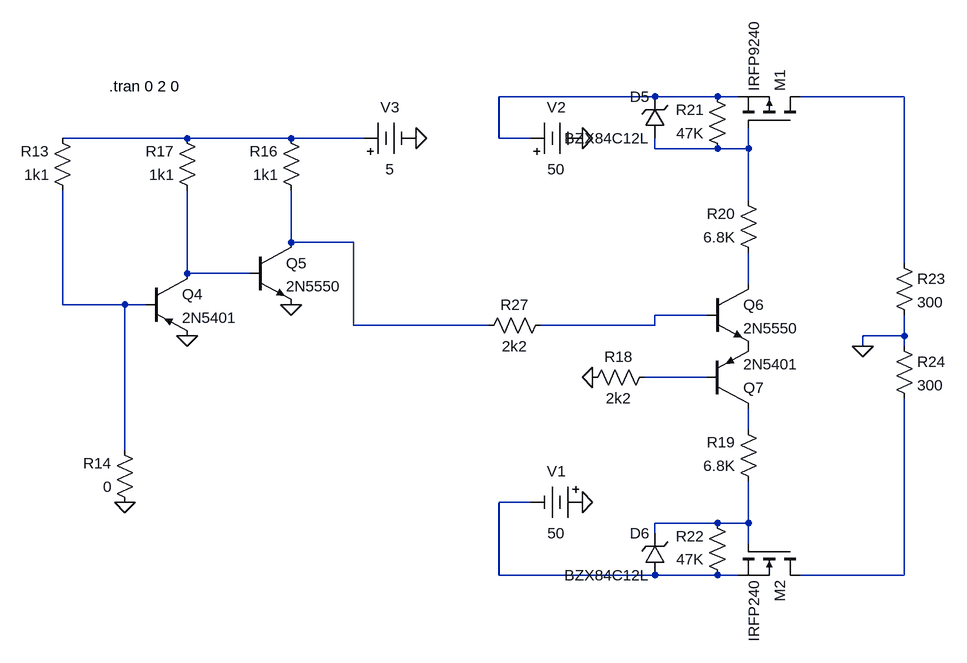
[diagram p0: schematic spkprot1.asc]
spkprot1.asc, the LTspice schematic file:
Version 4
SHEET 1 2068 900
WIRE 1600 -16 1360 -16
WIRE 1696 -16 1600 -16
WIRE 1728 -16 1696 -16
WIRE 1984 -16 1824 -16
WIRE 880 48 688 48
WIRE 1040 48 880 48
WIRE 1152 48 1040 48
WIRE 1360 48 1360 -16
WIRE 1408 48 1360 48
WIRE 1600 64 1600 48
WIRE 1696 64 1600 64
WIRE 1744 64 1744 32
WIRE 1744 64 1696 64
WIRE 1744 144 1744 64
WIRE 1040 208 1040 128
WIRE 1136 208 1040 208
WIRE 1984 240 1984 -16
WIRE 880 256 880 128
WIRE 976 256 880 256
WIRE 1744 272 1744 224
WIRE 688 304 688 128
WIRE 784 304 688 304
WIRE 816 304 784 304
WIRE 1680 320 1600 320
WIRE 1136 336 1136 208
WIRE 1344 336 1136 336
WIRE 1600 336 1600 320
WIRE 1600 336 1424 336
WIRE 1984 352 1984 320
WIRE 1984 352 1920 352
WIRE 1920 368 1920 352
WIRE 1984 368 1984 352
WIRE 1680 416 1584 416
WIRE 1744 496 1744 464
WIRE 784 528 784 304
WIRE 1408 608 1360 608
WIRE 1696 640 1600 640
WIRE 1744 640 1744 576
WIRE 1744 640 1696 640
WIRE 1600 656 1600 640
WIRE 1744 672 1744 640
WIRE 1360 720 1360 608
WIRE 1600 720 1360 720
WIRE 1696 720 1600 720
WIRE 1728 720 1696 720
WIRE 1984 720 1984 448
WIRE 1984 720 1824 720
FLAG 880 352 0
FLAG 1488 48 0
FLAG 1488 608 0
FLAG 1040 304 0
FLAG 1504 416 0
FLAG 1920 368 0
FLAG 1232 48 0
FLAG 784 608 0
SYMBOL res 704 144 R180
WINDOW 0 36 76 Left 2
WINDOW 3 36 40 Left 2
SYMATTR InstName R13
SYMATTR Value 1k1
SYMBOL res 800 624 R180
WINDOW 0 36 76 Left 2
WINDOW 3 36 40 Left 2
SYMATTR InstName R14
SYMATTR Value 0
SYMBOL pnp 816 256 R0
SYMATTR InstName Q4
SYMATTR Value 2N5401
SYMBOL res 896 144 R180
WINDOW 0 36 76 Left 2
WINDOW 3 36 40 Left 2
SYMATTR InstName R17
SYMATTR Value 1k1
SYMBOL battery 1504 608 R90
WINDOW 0 -32 56 VBottom 2
WINDOW 3 32 56 VTop 2
WINDOW 123 0 0 Left 2
WINDOW 39 60 56 VTop 2
SYMATTR InstName V1
SYMATTR Value 50
SYMBOL battery 1392 48 R270
WINDOW 0 32 56 VTop 2
WINDOW 3 -32 56 VBottom 2
WINDOW 123 0 0 Left 2
WINDOW 39 -60 56 VBottom 2
SYMATTR InstName V2
SYMATTR Value 50
SYMBOL npn 976 208 R0
SYMATTR InstName Q5
SYMATTR Value 2N5550
SYMBOL res 1056 144 R180
WINDOW 0 36 76 Left 2
WINDOW 3 36 40 Left 2
SYMATTR InstName R16
SYMATTR Value 1k1
SYMBOL npn 1680 272 R0
SYMATTR InstName Q6
SYMATTR Value 2N5550
SYMBOL pnp 1680 464 M180
SYMATTR InstName Q7
SYMATTR Value 2N5401
SYMBOL res 1488 432 R270
WINDOW 0 32 56 VTop 2
WINDOW 3 0 56 VBottom 2
SYMATTR InstName R18
SYMATTR Value 2k2
SYMBOL res 1760 592 R180
WINDOW 0 36 76 Left 2
WINDOW 3 36 40 Left 2
SYMATTR InstName R19
SYMATTR Value 6.8K
SYMBOL res 1760 240 R180
WINDOW 0 36 76 Left 2
WINDOW 3 36 40 Left 2
SYMATTR InstName R20
SYMATTR Value 6.8K
SYMBOL pmos 1824 32 M270
SYMATTR InstName M1
SYMATTR Value IRFP9240
SYMBOL nmos 1824 672 R90
SYMATTR InstName M2
SYMATTR Value IRFP240
SYMBOL res 1712 80 R180
WINDOW 0 36 76 Left 2
WINDOW 3 36 40 Left 2
SYMATTR InstName R21
SYMATTR Value 47K
SYMBOL res 1712 736 R180
WINDOW 0 36 76 Left 2
WINDOW 3 36 40 Left 2
SYMATTR InstName R22
SYMATTR Value 47K
SYMBOL zener 1616 48 R180
WINDOW 0 24 64 Left 2
WINDOW 3 24 0 Left 2
SYMATTR InstName D5
SYMATTR Value BZX84C12L
SYMBOL zener 1616 720 R180
WINDOW 0 24 64 Left 2
WINDOW 3 24 0 Left 2
SYMATTR InstName D6
SYMATTR Value BZX84C12L
SYMBOL res 1968 224 R0
SYMATTR InstName R23
SYMATTR Value 300
SYMBOL res 1968 352 R0
SYMATTR InstName R24
SYMATTR Value 300
SYMBOL res 1328 352 R270
WINDOW 0 32 56 VTop 2
WINDOW 3 0 56 VBottom 2
SYMATTR InstName R27
SYMATTR Value 2k2
SYMBOL battery 1136 48 R270
WINDOW 0 32 56 VTop 2
WINDOW 3 -32 56 VBottom 2
WINDOW 123 0 0 Left 2
WINDOW 39 -60 56 VBottom 2
SYMATTR InstName V3
SYMATTR Value 5
TEXT 760 -32 Left 2 !.tran 0 2 0

The netlist it stands for:
* spkprot1.asc
R13 N008 N003 1k1
R14 0 N008 0
Q4 N006 N008 0 0 2N5401
R17 N006 N003 1k1
V1 0 N012 50
V2 N001 0 50
Q5 N005 N006 0 0 2N5550
R16 N005 N003 1k1
Q6 N007 N009 P001 0 2N5550
Q7 N011 N010 P001 0 2N5401
R18 0 N010 2k2
R19 N013 N011 6.8K
R20 N007 N004 6.8K
M1 N002 N004 N001 N001 IRFP9240
M2 N014 N013 N012 N012 IRFP240
R21 N004 N001 47K
R22 N012 N013 47K
D5 N004 N001 BZX84C12L
D6 N012 N013 BZX84C12L
R23 N002 0 300
R24 0 N014 300
R27 N005 N009 2k2
V3 N003 0 5
.model D D
.lib standard.dio
.model NPN NPN
.model PNP PNP
.lib standard.bjt
.model NMOS NMOS
.model PMOS PMOS
.lib standard.mos
.tran 0 2 0
.backanno
.end